# Altium schematic sheet board1.SchDoc
size A4
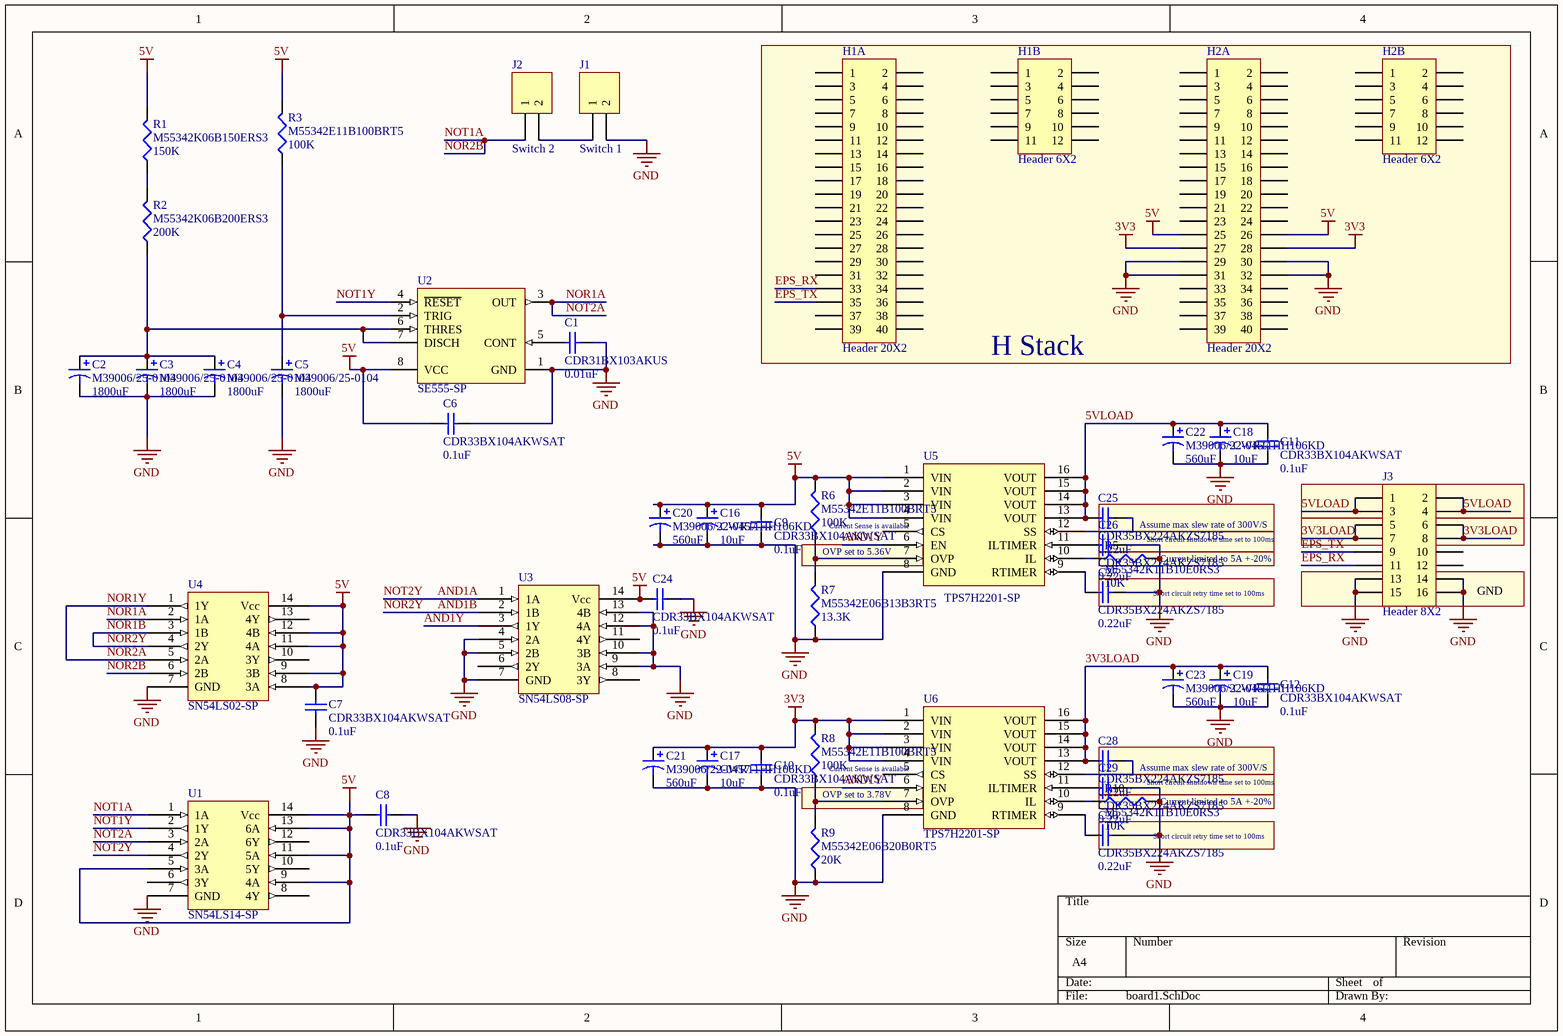
[diagram p0: board1.SchDoc]

## Parts
C1  CDR31BX103AKUS  value 0.01uF  [*RESC2012X64N]
C2  M39006/25-0104  value 1800uF  [M39006/25-0104]
C3  M39006/25-0104  value 1800uF  [M39006/25-0104]
C4  M39006/25-0104  value 1800uF  [M39006/25-0104]
C5  M39006/25-0104  value 1800uF  [M39006/25-0104]
C6  CDR33BX104AKWSAT  value 0.1uF  [*CAPC3225X125N]
C7  CDR33BX104AKWSAT  value 0.1uF  [*CAPC3225X125N]
C8  CDR33BX104AKWSAT  value 0.1uF  [*CAPC3225X125N]
C9  CDR33BX104AKWSAT  value 0.1uF  [*CAPC3225X125N]
C10  CDR33BX104AKWSAT  value 0.1uF  [*CAPC3225X125N]
C11  CDR33BX104AKWSAT  value 0.1uF  [*CAPC3225X125N]
C12  CDR33BX104AKWSAT  value 0.1uF  [*CAPC3225X125N]
C16  CWR11HH106KD  value 10uF  [*CAPCP6032X280N]
C17  CWR11HH106KD  value 10uF  [*CAPCP6032X280N]
C18  CWR11HH106KD  value 10uF  [*CAPCP6032X280N]
C19  CWR11HH106KD  value 10uF  [*CAPCP6032X280N]
C20  M39006/22-0457  value 560uF  [M39006/22-0457]
C21  M39006/22-0457  value 560uF  [M39006/22-0457]
C22  M39006/22-0457  value 560uF  [M39006/22-0457]
C23  M39006/22-0457  value 560uF  [M39006/22-0457]
C24  CDR33BX104AKWSAT  value 0.1uF  [*CAPC3225X125N]
C25  CDR35BX224AKZS7185  value 0.22uF  [*CAPC4663X340N]
C26  CDR35BX224AKZS7185  value 0.22uF  [*CAPC4663X340N]
C27  CDR35BX224AKZS7185  value 0.22uF  [*CAPC4663X340N]
C28  CDR35BX224AKZS7185  value 0.22uF  [*CAPC4663X340N]
C29  CDR35BX224AKZS7185  value 0.22uF  [*CAPC4663X340N]
C30  CDR35BX224AKZS7185  value 0.22uF  [*CAPC4663X340N]
H1A  Header 20X2  [HDR2X20]
H1B  Header 6X2  [HDR2X6]
H2A  Header 20X2  [HDR2X20]
H2B  Header 6X2  [HDR2X6]
J1  Switch 1  [HDR1X2]
J2  Switch 2  [HDR1X2]
J3  Header 8X2  [HDR2X8]
R1  M55342K06B150ERS3  value 150K  [*RESC2012X64N]
R2  M55342K06B200ERS3  value 200K  [*RESC2012X64N]
R3  M55342E11B100BRT5  value 100K  [*RESC1005X84N]
R5  M55342K11B10E0RS3  value 10K  [*RESC1005X84N]
R6  M55342E11B100BRT5  value 100K  [*RESC1005X84N]
R7  M55342E06B13B3RT5  value 13.3K  [*RESC2012X64N]
R8  M55342E11B100BRT5  value 100K  [*RESC1005X84N]
R9  M55342E06B20B0RT5  value 20K  [*RESC2012X64N]
R10  M55342K11B10E0RS3  value 10K  [*RESC1005X84N]
U1  SN54LS14-SP  [SN54LS14-SP]
U2  SE555-SP  [P0008A]
U3  SN54LS08-SP  [SN54LS08-SP]
U4  SN54LS02-SP  [SN54LS02-SP]
U5  TPS7H2201-SP  [TPS7H2201-SP]
U6  TPS7H2201-SP  [TPS7H2201-SP]

## Blocks framed on the sheet
H Stack: H1A H1B H2A H2B
Assume max slew rate of 300V/S: C26
Current limited to 5A +-20%: C27
Assume max slew rate of 300V/S: C29
Current limited to 5A +-20%: C30

## Nets
3V3: C10.1 C17.1 C21.1 H2A.27 H2A.28 R8.2 U6.1(VIN) U6.2(VIN) U6.3(VIN) U6.4(VIN)
5V: C6.1 C7.2 C8.2 C9.1 C16.1 C20.1 C24.1 H2A.25 H2A.26 R1.2 R3.2 R6.2 U1.5(3A) U1.9(4A) U1.11(5A) U1.13(6A) U1.14(Vcc) U2.8(VCC) U3.14(Vcc) U4.8(3A) U4.9(3B) U4.11(4A) U4.12(4B) U4.14(Vcc) U5.1(VIN) U5.2(VIN) U5.3(VIN) U5.4(VIN)
GND: C1.2 C2.2 C3.2 C4.2 C5.2 C6.2 C7.1 C8.1 C9.2 C10.2 C11.2 C12.2 C16.2 C17.2 C18.2 C19.2 C20.2 C21.2 C22.2 C23.2 C24.2 C26.2 C27.2 C29.2 C30.2 H2A.29 H2A.30 H2A.31 H2A.32 J1.2 J3.13 J3.14 J3.15 J3.16 R5.2 R7.1 R9.1 R10.2 U1.7(GND) U2.1(GND) U3.4(2A) U3.5(2B) U3.7(GND) U3.9(3A) U3.10(3B) U3.12(4A) U3.13(4B) U4.7(GND) U5.8(GND) U6.8(GND)
3V3LOAD: C12.1 C19.1 C23.1 C28.1 J3.5 J3.6 J3.7 J3.8 U6.13(VOUT) U6.14(VOUT) U6.15(VOUT) U6.16(VOUT)
5VLOAD: C11.1 C18.1 C22.1 C25.1 J3.1 J3.2 J3.3 J3.4 U5.13(VOUT) U5.14(VOUT) U5.15(VOUT) U5.16(VOUT)
AND1A: U1.4(2Y) U3.1(1A)  [also labelled NOT2Y]
AND1B: U3.2(1B) U4.3(1B) U4.4(2Y)  [also labelled NOR1B, NOR2Y]
AND1Y: U3.3(1Y) U5.6(EN) U6.6(EN)
EPS_RX: H1A.33 J3.11
EPS_TX: H1A.35 J3.9
NOR1A: U1.3(2A) U2.3(OUT) U4.2(1A)  [also labelled NOT2A]
NOR1Y: U4.1(1Y) U4.5(2A)  [also labelled NOR2A]
NOR2B: J2.1 U1.1(1A) U4.6(2B)  [also labelled NOT1A]
NOT1Y: U1.2(1Y) U2.4(~{RESET})
NetC1_1: C1.1 U2.5(CONT)
NetC2_1: C2.1 C3.1 C4.1 R2.1 U2.6(THRES) U2.7(DISCH)
NetC5_1: C5.1 R3.1 U2.2(TRIG)
NetC25_2: C25.2 U5.12(SS)
NetC26_1: C26.1 U5.11(ILTIMER)
NetC27_1: C27.1 U5.9(RTIMER)
NetC28_2: C28.2 U6.12(SS)
NetC29_1: C29.1 U6.11(ILTIMER)
NetC30_1: C30.1 U6.9(RTIMER)
NetJ1_1: J1.1 J2.2
NetR1_1: R1.1 R2.2
NetR5_1: R5.1 U5.10(IL)
NetR6_1: R6.1 R7.2 U5.7(OVP)
NetR8_1: R8.1 R9.2 U6.7(OVP)
NetR10_1: R10.1 U6.10(IL)

Not connected (* = marked no-connect by the designer): H1A 1 2 3 4 5 6 7 8 9 10 11 12 13 14 15 16 17 18 19 20 21 22 23 24 25 26 27 28 29 30 31 32 34 36 37 38 39 40; H1B 1 2 3 4 5 6 7 8 9 10 11 12; H2A 1 2 3 4 5 6 7 8 9 10 11 12 13 14 15 16 17 18 19 20 21 22 23 24 33 34 35 36 37 38 39 40; H2B 1 2 3 4 5 6 7 8 9 10 11 12; J3 10 12; U1 6(3Y) 8(4Y) 10(5Y) 12(6Y); U3 6(2Y) 8(3Y) 11(4Y); U4 10(3Y) 13(4Y); U5 5(CS); U6 5(CS)

## Notes on the sheet
- OVP set to 5.36V
- (near U5) Current Sense is available
- (near R5) Short circuit shutdown time set to 100ms
- Short circuit retry time set to 100ms
- (near J3) GND
- (near U6) Current Sense is available
- (near R10) Short circuit shutdown time set to 100ms
- OVP set to 3.78V

## Library data of the parts
C1 = CDR31BX103AKUS: 0.01uF
C2-C5 = M39006/25-0104: 1800uF
C6-C12 C24 = CDR33BX104AKWSAT: 0.1uF
C16-C19 = CWR11HH106KD: 10uF
C20-C23 = M39006/22-0457: 560uF
C25-C30 = CDR35BX224AKZS7185: 0.22uF
H1A H2A = Header 20X2: Header, 20-Pin, Dual row; LatestRevisionDate: 17-Jul-2002; LatestRevisionNote: Re-released for DXP Platform.; Publisher: Altium Limited
H1B H2B = Header 6X2: Header, 6-Pin, Dual row; LatestRevisionDate: 17-Jul-2002; LatestRevisionNote: Re-released for DXP Platform.; Publisher: Altium Limited
J1 J2 = Header 2: Header, 2-Pin; LatestRevisionDate: 17-Jul-2002; LatestRevisionNote: Re-released for DXP Platform.; Publisher: Altium Limited
J3 = Header 8X2: Header, 8-Pin, Dual row; LatestRevisionDate: 17-Jul-2002; LatestRevisionNote: Re-released for DXP Platform.; Publisher: Altium Limited
R1 = M55342K06B150ERS3: 150K
R2 = M55342K06B200ERS3: 200K
R3 R6 R8 = M55342E11B100BRT5: 100K
R5 R10 = M55342K11B10E0RS3: 10K
R7 = M55342E06B13B3RT5: 13.3K
R9 = M55342E06B20B0RT5: 20K
U1 = SN54LS14-SP: Invertor
U2 = CMP-2000-04954-1: Precision Timer, 4.5 to 16 V, -55 to 125 degC, 8-Pin DIP, Pb-Free, Tube; Manufacturer: TexasInstruments; Maximum High Level Output Current: -200mA; Number of Internal Timers: 1; Operating Supply Voltage: 5; Maximum Low Level Output Current: 200mA; Rad Hard: No; Packaging: Rail/Tube; Manufacturer URL: http://www.ti.com/; Package Reference: P8; Package Description: 8-Pin Double In-line Package, Body 9.59 x 6.35 mm, Pitch 2.54 mm; Package URL: http://www.ti.com/lit/ml/mpdi001b/mpdi001b.pdf; Type: Standard; Datasheet URL: http://www.ti.com/general/docs/lit/getliterature.tsp?genericPartNumber=NE555&fileType=pdf; Category: Timer; Package: 8PDIP; Datasheet Version: Rev. I, 09/2014
U3 = SN54LS08-SP: AND gate
U4 = SN54LS02-SP: NOR gate